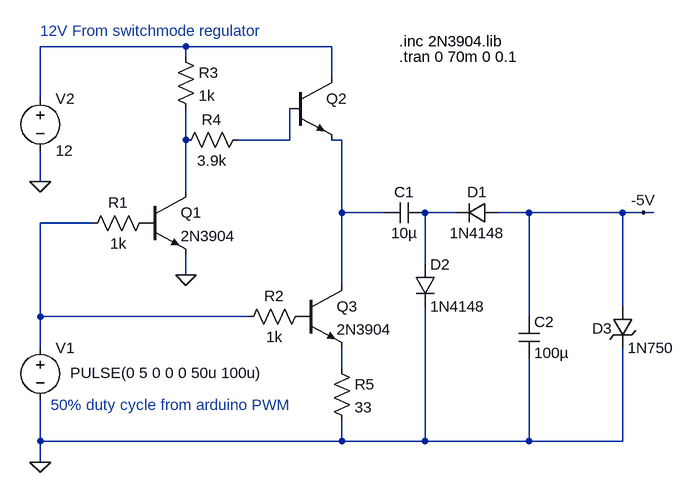
[diagram p0: schematic ChargeP.asc]
ChargeP.asc, the LTspice schematic file:
Version 4
SHEET 1 1476 680
WIRE 304 0 80 0
WIRE 528 0 304 0
WIRE 304 16 304 0
WIRE 528 48 528 0
WIRE 80 80 80 0
WIRE 304 144 304 96
WIRE 464 144 464 96
WIRE 464 144 384 144
WIRE 544 144 528 144
WIRE 80 208 80 160
WIRE 304 224 304 144
WIRE 544 256 544 144
WIRE 608 256 544 256
WIRE 720 256 672 256
WIRE 832 256 784 256
WIRE 976 256 832 256
WIRE 1008 256 976 256
WIRE 1024 256 1008 256
WIRE 160 272 80 272
WIRE 672 336 672 256
WIRE 304 352 304 320
WIRE 544 368 544 256
WIRE 976 400 976 256
WIRE 80 416 80 272
WIRE 400 416 80 416
WIRE 832 416 832 256
WIRE 80 464 80 416
WIRE 544 496 544 464
WIRE 80 608 80 544
WIRE 544 608 544 576
WIRE 544 608 80 608
WIRE 672 608 672 400
WIRE 672 608 544 608
WIRE 832 608 832 480
WIRE 832 608 672 608
WIRE 976 608 976 464
WIRE 976 608 832 608
WIRE 80 640 80 608
FLAG 80 640 0
FLAG 304 352 0
FLAG 80 208 0
FLAG 1008 256 -5V
SYMBOL npn 240 224 R0
SYMATTR InstName Q1
SYMATTR Value 2N3904
SYMBOL npn 464 48 R0
WINDOW 3 56 68 Invisible 2
SYMATTR Value 2N3904
SYMATTR InstName Q2
SYMBOL npn 480 368 R0
SYMATTR InstName Q3
SYMATTR Value 2N3904
SYMBOL voltage 80 448 R0
WINDOW 123 0 0 Left 0
WINDOW 39 0 0 Left 0
WINDOW 3 46 55 Left 2
SYMATTR InstName V1
SYMATTR Value PULSE(0 5 0 0 0 50u 100u)
SYMBOL res 256 256 R90
WINDOW 0 0 56 VBottom 2
WINDOW 3 32 56 VTop 2
SYMATTR InstName R1
SYMATTR Value 1k
SYMBOL res 496 400 R90
WINDOW 0 0 56 VBottom 2
WINDOW 3 32 56 VTop 2
SYMATTR InstName R2
SYMATTR Value 1k
SYMBOL res 288 0 R0
SYMATTR InstName R3
SYMATTR Value 1k
SYMBOL voltage 80 64 R0
SYMATTR InstName V2
SYMATTR Value 12
SYMBOL res 400 128 R90
WINDOW 0 0 56 VBottom 2
WINDOW 3 32 56 VTop 2
SYMATTR InstName R4
SYMATTR Value 3.9k
SYMBOL res 528 480 R0
SYMATTR InstName R5
SYMATTR Value 33
SYMBOL cap 672 240 R90
WINDOW 0 0 32 VBottom 2
WINDOW 3 32 32 VTop 2
SYMATTR InstName C1
SYMATTR Value 10µ
SYMBOL diode 784 240 R90
WINDOW 0 0 32 VBottom 2
WINDOW 3 32 32 VTop 2
SYMATTR InstName D1
SYMATTR Value 1N4148
SYMBOL diode 656 336 R0
SYMATTR InstName D2
SYMATTR Value 1N4148
SYMBOL cap 816 416 R0
SYMATTR InstName C2
SYMATTR Value 100µ
SYMBOL zener 960 400 R0
WINDOW 0 -31 34 Left 2
SYMATTR InstName D3
SYMATTR Value 1N750
TEXT 632 -8 Left 2 !.inc 2N3904.lib
TEXT 632 16 Left 2 !.tran 0 70m 0 0.1
TEXT 96 552 Left 2 ;50% duty cycle from arduino PWM
TEXT 80 -24 Left 2 ;12V From switchmode regulator

The netlist it stands for:
* ChargeP.asc
Q1 N002 P001 0 0 2N3904
Q2 N001 N003 N004 0 2N3904
Q3 N004 P002 N007 0 2N3904
V1 N006 0 PULSE(0 5 0 0 0 50u 100u)
R1 P001 N006 1k
R2 P002 N006 1k
R3 N001 N002 1k
V2 N001 0 12
R4 N003 N002 3.9k
R5 N007 0 33
C1 N005 N004 10µ
D1 -5V N005 1N4148
D2 N005 0 1N4148
C2 -5V 0 100µ
D3 -5V 0 1N750
.model D D
.lib standard.dio
.model NPN NPN
.model PNP PNP
.lib standard.bjt
.inc 2N3904.lib
.tran 0 70m 0 0.1
* 50% duty cycle from arduino PWM
* 12V From switchmode regulator
.backanno
.end